# Altium schematic sheet 26P1.SchDoc
size A4
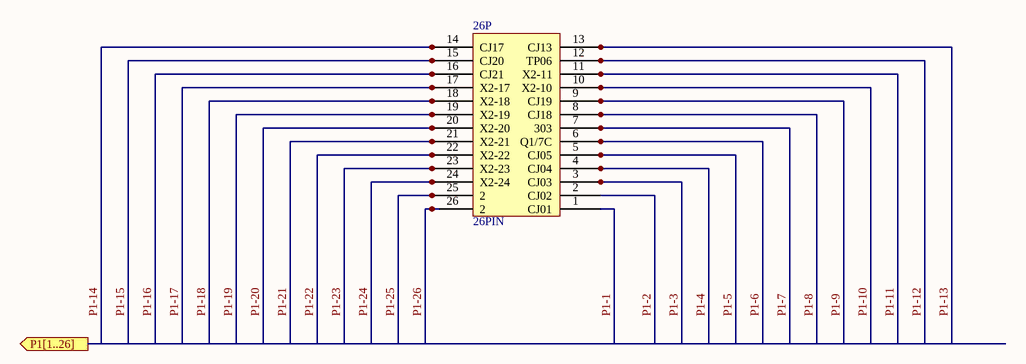
[diagram p0: 26P1.SchDoc]

## Parts
26P  26PIN

## Ports
P1[1..26] (out)

## Nets
P1-1: 26P.1(CJ01)
P1-2: 26P.2(CJ02)
P1-3: 26P.3(CJ03)
P1-4: 26P.4(CJ04)
P1-5: 26P.5(CJ05)
P1-6: 26P.6(Q1/7C)
P1-7: 26P.7(303)
P1-8: 26P.8(CJ18)
P1-9: 26P.9(CJ19)
P1-10: 26P.10(X2-10)
P1-11: 26P.11(X2-11)
P1-12: 26P.12(TP06)
P1-13: 26P.13(CJ13)
P1-14: 26P.14(CJ17)
P1-15: 26P.15(CJ20)
P1-16: 26P.16(CJ21)
P1-17: 26P.17(X2-17)
P1-18: 26P.18(X2-18)
P1-19: 26P.19(X2-19)
P1-20: 26P.20(X2-20)
P1-21: 26P.21(X2-21)
P1-22: 26P.22(X2-22)
P1-23: 26P.23(X2-23)
P1-24: 26P.24(X2-24)
P1-25: 26P.25(2)
P1-26: 26P.26(2)

## Library data of the parts
26P = Component_1